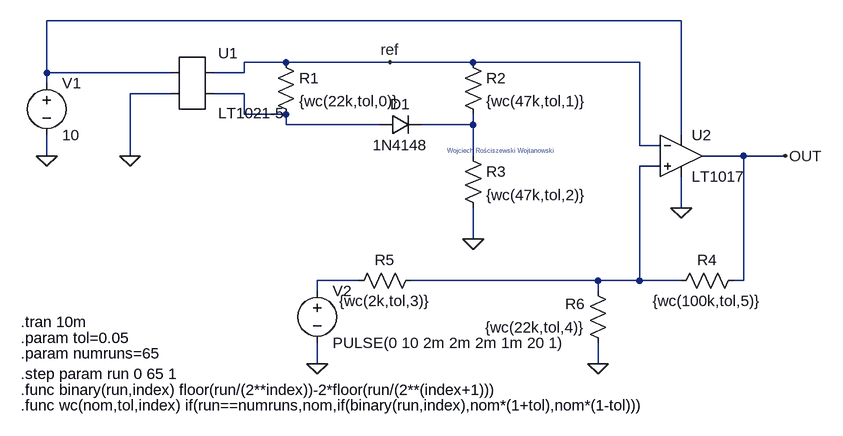
[diagram p0: schematic Amplifier Circuit WC Analysis 3 with comparator.asc]
Amplifier Circuit WC Analysis 3 with comparator.asc, the LTspice schematic file:
Version 4
SHEET 1 956 936
WIRE 688 -160 -288 -160
WIRE 80 -96 16 -96
WIRE 240 -96 80 -96
WIRE 368 -96 240 -96
WIRE 624 -96 368 -96
WIRE -288 -80 -288 -160
WIRE -96 -80 -288 -80
WIRE 16 -80 16 -96
WIRE 16 -80 -32 -80
WIRE -288 -64 -288 -80
WIRE -96 -48 -160 -48
WIRE 16 -48 -32 -48
WIRE 16 -16 16 -48
WIRE 80 -16 16 -16
WIRE 80 0 80 -16
WIRE 224 0 80 0
WIRE 368 0 368 -16
WIRE 368 0 288 0
WIRE 688 16 688 -160
WIRE 624 32 624 -96
WIRE 656 32 624 32
WIRE -288 48 -288 16
WIRE -160 48 -160 -48
WIRE 368 48 368 0
WIRE 784 48 720 48
WIRE 848 48 784 48
WIRE 656 64 624 64
WIRE 688 128 688 80
WIRE 368 176 368 128
WIRE 192 240 128 240
WIRE 560 240 272 240
WIRE 624 240 624 64
WIRE 624 240 560 240
WIRE 688 240 624 240
WIRE 784 240 784 48
WIRE 784 240 768 240
WIRE 128 256 128 240
WIRE 560 256 560 240
WIRE 128 368 128 336
WIRE 560 368 560 336
FLAG -288 48 0
FLAG -160 48 0
FLAG 368 176 0
FLAG 688 128 0
FLAG 848 48 OUT
FLAG 240 -96 ref
FLAG 560 368 0
FLAG 128 368 0
SYMBOL voltage -288 -80 R0
WINDOW 123 0 0 Left 0
WINDOW 39 0 0 Left 0
SYMATTR InstName V1
SYMATTR Value 10
SYMBOL AutoGenerated\\LT1021-5 -64 -64 R0
SYMATTR InstName U1
SYMBOL res 64 -112 R0
SYMATTR InstName R1
SYMATTR Value {wc(22k,tol,0)}
SYMBOL diode 224 16 R270
WINDOW 0 32 32 VTop 2
WINDOW 3 0 32 VBottom 2
SYMATTR InstName D1
SYMATTR Value 1N4148
SYMBOL res 352 -112 R0
SYMATTR InstName R2
SYMATTR Value {wc(47k,tol,1)}
SYMBOL res 352 32 R0
SYMATTR InstName R3
SYMATTR Value {wc(47k,tol,2)}
SYMBOL Comparators\\LT1017 688 48 R0
SYMATTR InstName U2
SYMBOL res 784 224 R90
WINDOW 0 0 56 VBottom 2
WINDOW 3 32 56 VTop 2
SYMATTR InstName R4
SYMATTR Value {wc(100k,tol,5)}
SYMBOL res 288 224 R90
WINDOW 0 0 56 VBottom 2
WINDOW 3 32 56 VTop 2
SYMATTR InstName R5
SYMATTR Value {wc(2k,tol,3)}
SYMBOL res 576 352 R180
WINDOW 0 36 76 Left 2
WINDOW 3 36 40 Left 2
SYMATTR InstName R6
SYMATTR Value {wc(22k,tol,4)}
SYMBOL voltage 128 240 R0
WINDOW 123 0 0 Left 0
WINDOW 39 0 0 Left 0
SYMATTR InstName V2
SYMATTR Value PULSE(0 10 2m 2m 2m 1m 20 1)
TEXT 328 40 Left 0 ;Wojciech Rościszewski Wojtanowski
TEXT -328 328 Left 2 !.param tol=0.05
TEXT -328 384 Left 2 !.step param run 0 65 1
TEXT -328 304 Left 2 !.tran 10m
TEXT -328 352 Left 2 !.param numruns=65
TEXT -328 408 Left 2 !.func binary(run,index) floor(run/(2**index))-2*floor(run/(2**(index+1)))
TEXT -328 432 Left 2 !.func wc(nom,tol,index) if(run==numruns,nom,if(binary(run,index),nom*(1+tol),nom*(1-tol)))

The netlist it stands for:
* Amplifier Circuit WC Analysis 3 with comparator.asc
V1 N001 0 10
* U1: LT1021-5 (symbol AutoGenerated\LT1021-5 not available, pins judged from their places): pin1=N001 pin2=0 pin3=ref pin4=N002
R1 ref N002 {wc(22k,tol,0)}
D1 N002 N003 1N4148
R2 ref N003 {wc(47k,tol,1)}
R3 N003 0 {wc(47k,tol,2)}
XU2 N004 ref N001 0 OUT LT1017  ; pins In+ In- V+ V- OUT
R4 OUT N004 {wc(100k,tol,5)}
R5 N004 N005 {wc(2k,tol,3)}
R6 0 N004 {wc(22k,tol,4)}
V2 N005 0 PULSE(0 10 2m 2m 2m 1m 20 1)
.model D D
.lib standard.dio
* Wojciech Rościszewski Wojtanowski
.param tol=0.05
.step param run 0 65 1
.tran 10m
.param numruns=65
.func binary(run,index) floor(run/(2**index))-2*floor(run/(2**(index+1)))
.func wc(nom,tol,index) if(run==numruns,nom,if(binary(run,index),nom*(1+tol),nom*(1-tol)))
.backanno
.end